# EAGLE schematic DSP HUB75 and Audio (EAGLE 9.6.1)
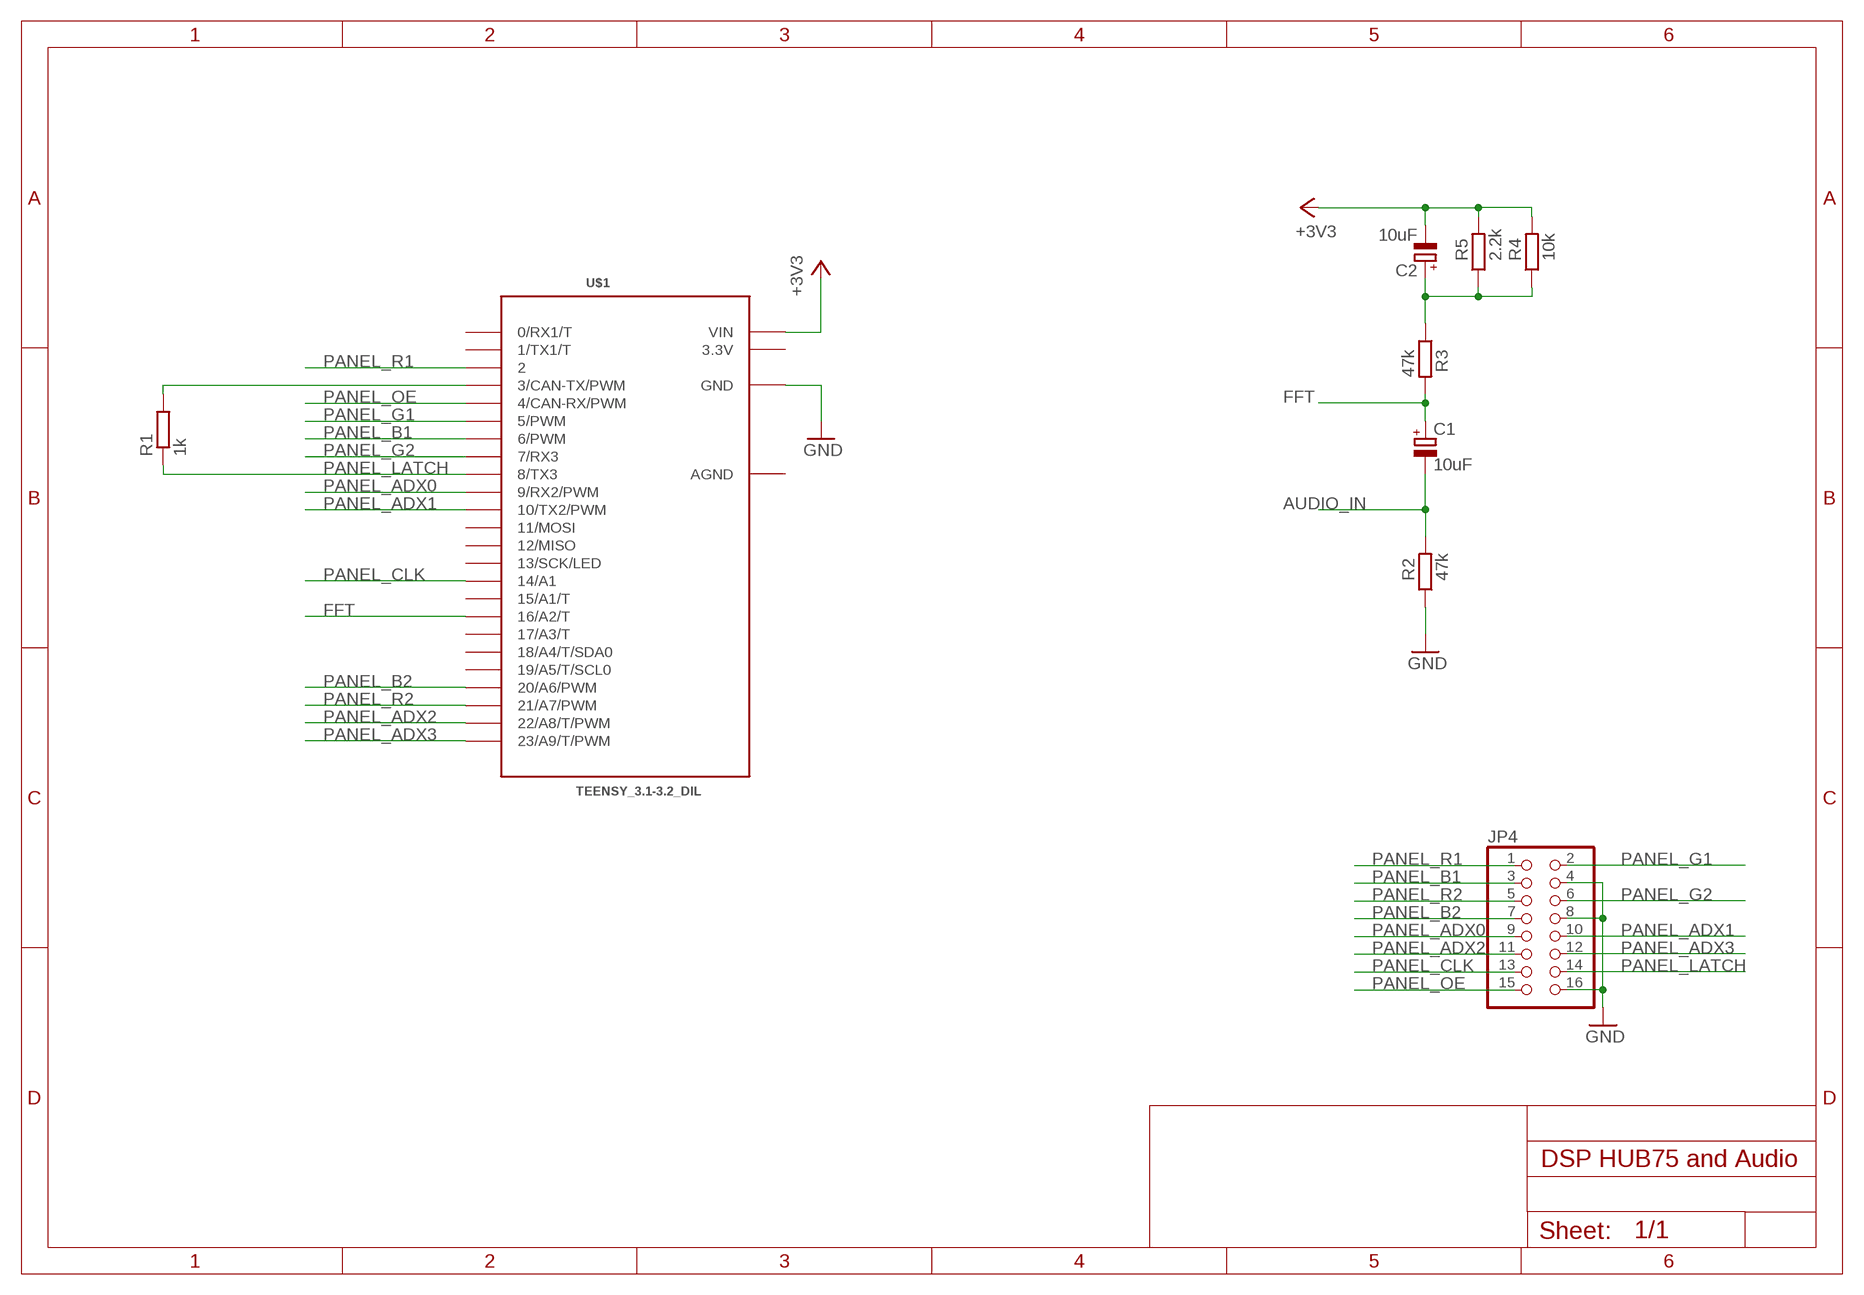
[diagram p0: schematic, sheet 1]

## Parts
C1  10uF  CPOL-EUE1.8-4  [E1,8-4]
C2  10uF  CPOL-EUE1.8-4  [E1,8-4]
JP4  PINHD-2X08_2.54  [2X08]
R1  1k  R-EU_0207/10  [0207/10]
R2  47k  R-EU_0207/10  [0207/10]
R3  47k  R-EU_0207/10  [0207/10]
R4  10k  R-EU_0207/10  [0207/10]
R5  2.2k  R-EU_0207/10  [0207/10]
U$1  TEENSY_3.1-3.2_DIL  [TEENSY_3.0-3.2&LC_DIL]

## Nets
+3V3: C2.- R4.2 R5.2 U$1.VIN
AUDIO_IN: C1.- R2.2
FFT: C1.+ R3.2 U$1.16/A2(16/A2/T)
GND [power]: JP4.4 JP4.8 JP4.16 R2.1 U$1.GND
N$1: R1.2 U$1.3(3/CAN-TX/PWM)
N$4: C2.+ R3.1 R4.1 R5.1
PANEL_ADX0: JP4.9 U$1.9(9/RX2/PWM)
PANEL_ADX1: JP4.10 U$1.10(10/TX2/PWM)
PANEL_ADX2: JP4.11 U$1.22/A8(22/A8/T/PWM)
PANEL_ADX3: JP4.12 U$1.23/A9(23/A9/T/PWM)
PANEL_B1: JP4.3 U$1.6(6/PWM)
PANEL_B2: JP4.7 U$1.20/A6(20/A6/PWM)
PANEL_CLK: JP4.13 U$1.14/A0(14/A1)
PANEL_G1: JP4.2 U$1.5(5/PWM)
PANEL_G2: JP4.6 U$1.7(7/RX3)
PANEL_LATCH: JP4.14 R1.1 U$1.8(8/TX3)
PANEL_OE: JP4.15 U$1.4(4/CAN-RX/PWM)
PANEL_R1: JP4.1 U$1.2
PANEL_R2: JP4.5 U$1.21/A7(21/A7/PWM)
Unconnected: U$1.0(0/RX1/T) U$1.1(1/TX1/T) U$1.11(11/MOSI) U$1.12(12/MISO) U$1.13(13/SCK/LED) U$1.15/A1(15/A1/T) U$1.17/A3(17/A3/T) U$1.18/A4(18/A4/T/SDA0) U$1.19/A5(19/A5/T/SCL0)

## Power pins joined to a net without a drawn wire
3.3V: U$1.3.3V
AGND: U$1.AGND

## Library data of the parts
C1 C2 = rcl:CPOL-EU: POLARIZED CAPACITOR, European symbol; SPICEPREFIX: C
JP4 = pinhead-2:PINHD-2X08: PIN HEADER
R1-R5 = rcl:R-EU_: RESISTOR, European symbol; SPICEPREFIX: R
U$1 = Teensy_3_and_LC_Series_Boards_v1.4:TEENSY_3.1-3.2_DIL: Teensy 3.1 or 3.2 in a DIL Layout.

## Net classes
0 default: width 0.254 mm
1 power: width 0.406 mm